# EAGLE design shield (EAGLE 6.4)
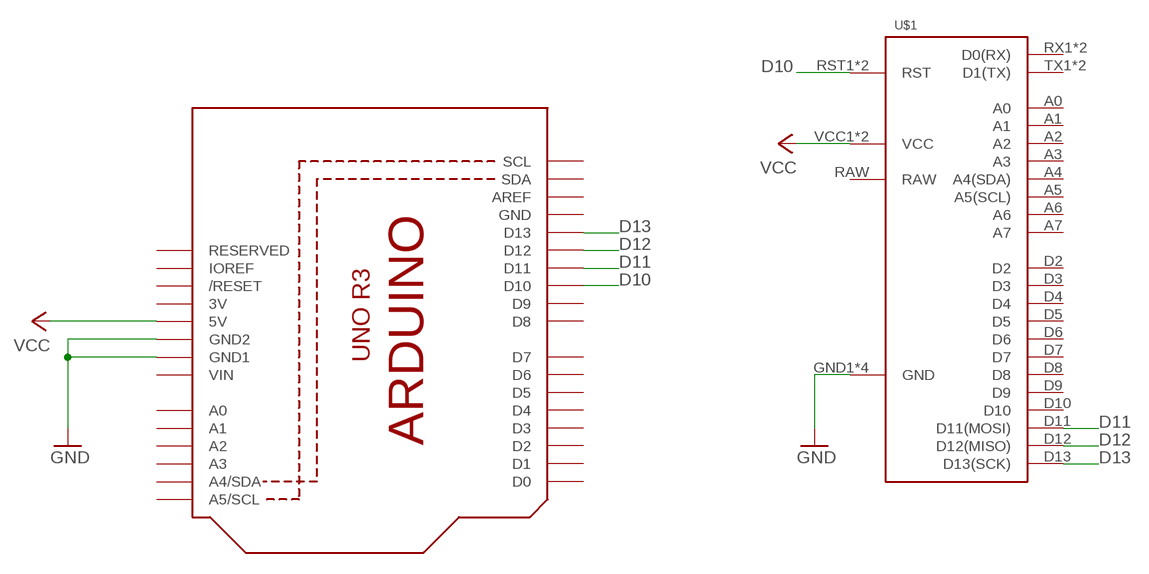
[diagram p0: schematic, sheet 1]

## Parts
U1  ARDUINOR3-DIMENSION  [ARDUINOR3]
U$1  ARDUINO-PRO-MINI  [ARDUINO-PRO-MINI]

## Nets
D10: U1.D10 U$1.RST1(RST) U$1.RST2(RST)
D11: U1.D11 U$1.D11(D11(MOSI))
D12: U1.D12 U$1.D12(D12(MISO))
D13: U1.D13 U$1.D13(D13(SCK))
GND: U1.GND1 U1.GND2 U$1.GND1(GND) U$1.GND2(GND) U$1.GND3(GND) U$1.GND4(GND)
VCC: U1.5V U$1.VCC1(VCC) U$1.VCC2(VCC)
Unconnected: U1.A0 U1.A1 U1.A2 U1.A3 U1.A4(A4/SDA) U1.A5(A5/SCL) U1.AREF U1.D0 U1.D1 U1.D2 U1.D3 U1.D4 U1.D5 U1.D6 U1.D7 U1.D8 U1.D9 U1.IOREF U1.RESERVED U1.RESET(/RESET) U1.SCL U1.SDA U$1.A0 U$1.A1 U$1.A2 U$1.A3 U$1.A4(A4(SDA)) U$1.A5(A5(SCL)) U$1.A6 U$1.A7 U$1.D2 U$1.D3 U$1.D4 U$1.D5 U$1.D6 U$1.D7 U$1.D8 U$1.D9 U$1.D10 U$1.RX1(D0(RX)) U$1.RX2(D0(RX)) U$1.TX1(D1(TX)) U$1.TX2(D1(TX))

## Power pins joined to a net without a drawn wire
3V: U1.3V
GND: U1.GND
RAW: U$1.RAW
VIN: U1.VIN

## Library data of the parts
U1 = adafruit:ARDUINOR3: This is a new object for the new Arduino R3 - with extra pins that you may want to use (such as IOref, and duplicated A4/A5
U$1 = serge:ARDUINO-PRO-MINI

## Board
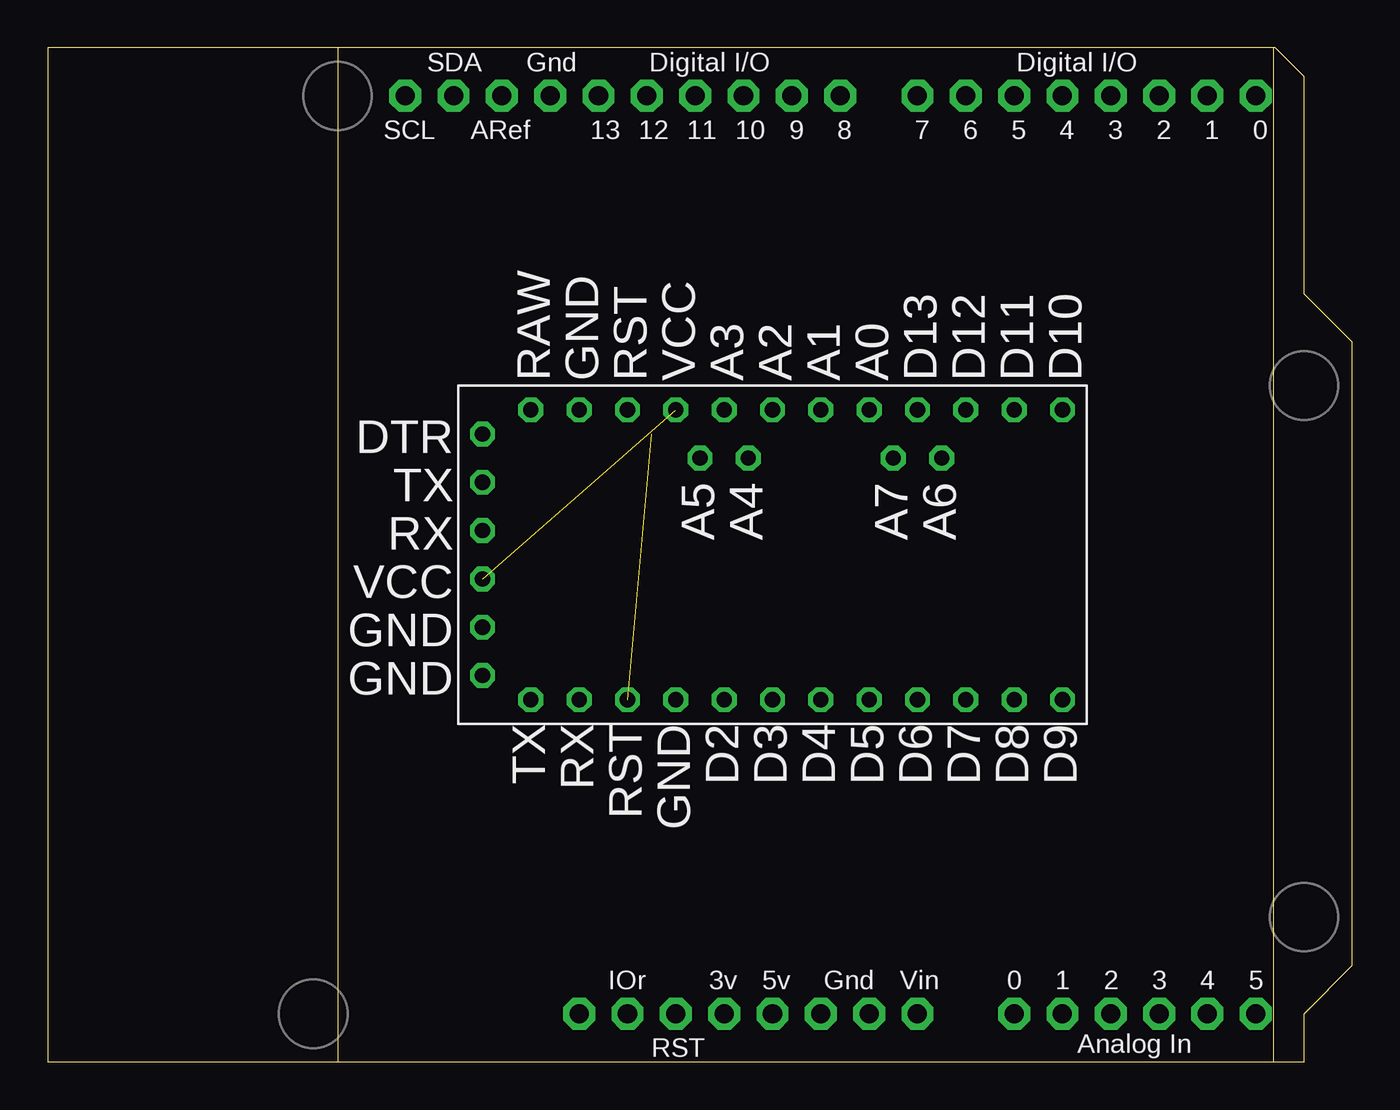
[diagram p1: board, top side]
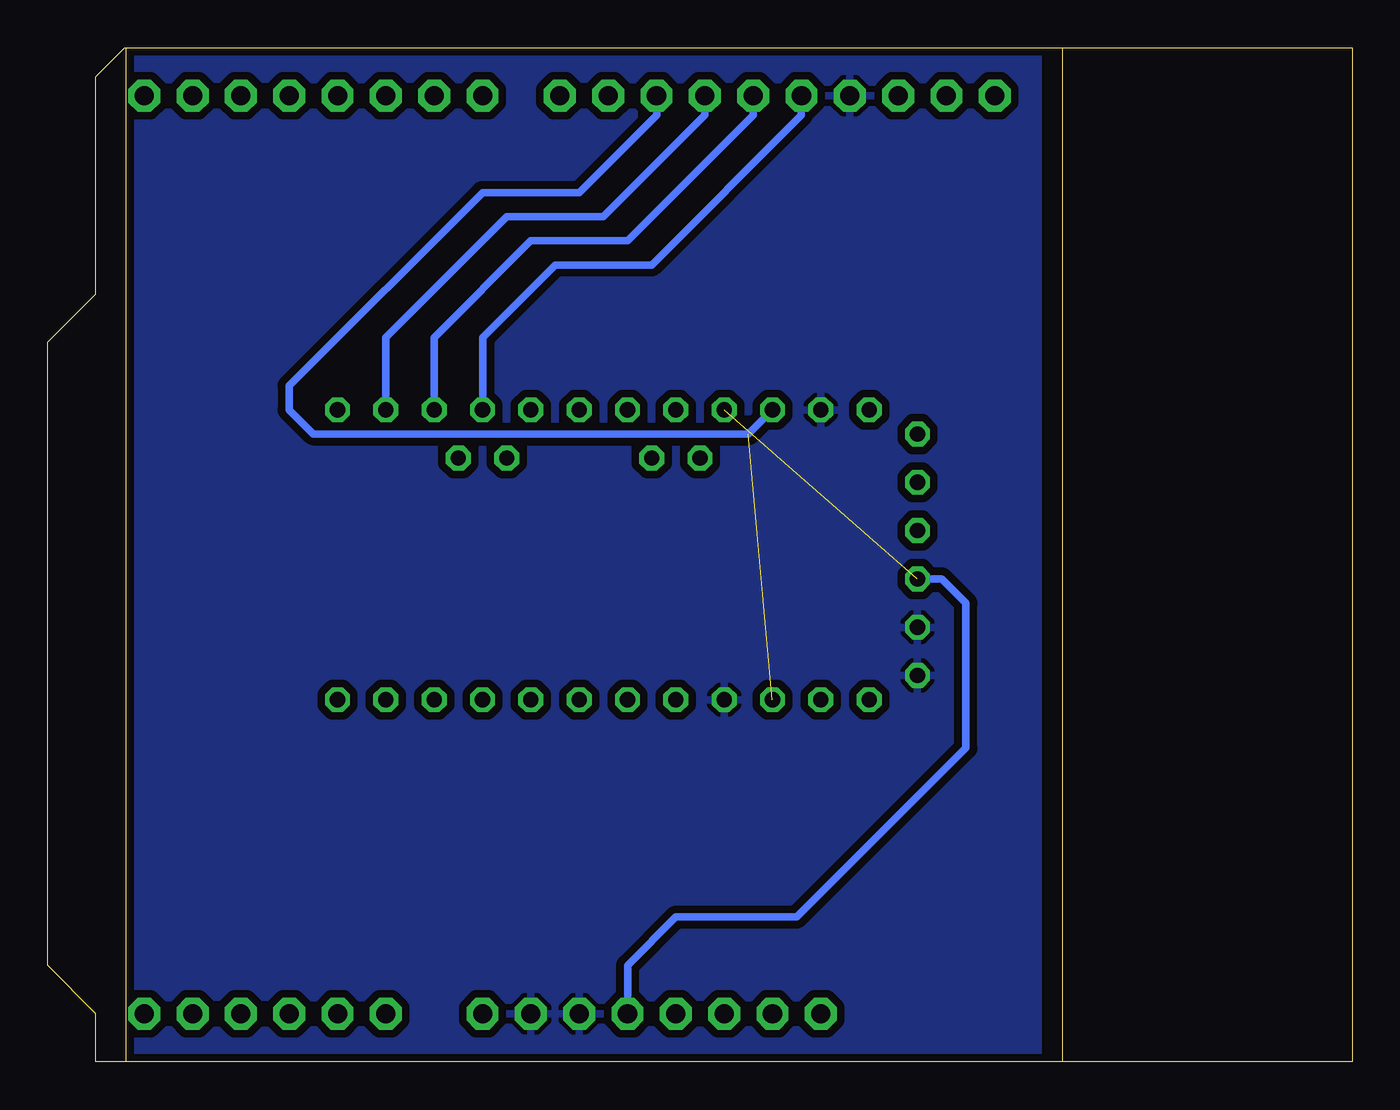
[diagram p2: board, bottom side, seen from below]

Size 49.2 x 53.33 mm. Coordinates in mm from the lower left corner, seen from the top.
Outline: 0,0 49.2,0 49.2,53.33 0,53.33 0,0
Copper layers (1*16): Top 0.035mm / dielectric 1.5mm / Bottom 0.035mm
Design rules "default": minimum track width 10mil, minimum drill 24mil, track to track 16mil, track to pad 16mil, pad to pad 16mil, via to via 16mil, smd to smd 16mil, copper to edge 16mil, drill to drill 8mil, minimum pad ring 10mil, minimum via ring 8mil, stop-mask expansion 4mil, vias tented up to drill 0mil, thermal gap 10mil

### Footprints (pad centres in the part's own frame; a part is rotated, then mirrored left to right if it is on the bottom)
ARDUINOR3 = drill 1 pad 1.676 octagon: 3V 35.56,2.54; 5V 38.1,2.54; A0 50.8,2.54; A1 53.34,2.54; A2 55.88,2.54; A3 58.42,2.54; A4 60.96,2.54; A5 63.5,2.54; AREF 23.876,50.8; D0 63.5,50.8; D1 60.96,50.8; D2 58.42,50.8; D3 55.88,50.8; D4 53.34,50.8; D5 50.8,50.8; D6 48.26,50.8; D7 45.72,50.8; D8 41.656,50.8; D9 39.116,50.8; D10 36.576,50.8; D11 34.036,50.8; D12 31.496,50.8; D13 28.956,50.8; GND 26.416,50.8; GND1 43.18,2.54; GND2 40.64,2.54; IOREF 30.48,2.54; RESERVED 27.94,2.54; RESET 33.02,2.54; SCL 18.796,50.8; SDA 21.336,50.8; VIN 45.72,2.54
ARDUINO-PRO-MINI = drill 0.8 octagon: A0 -3.81,-7.62; A1 -1.27,-7.62; A2 1.27,-7.62; A3 3.81,-7.62; A4 2.54,-5.08; A5 5.08,-5.08; A6 -7.62,-5.08; A7 -5.08,-5.08; D2 3.81,7.62; D3 1.27,7.62; D4 -1.27,7.62; D5 -3.81,7.62; D6 -6.35,7.62; D7 -8.89,7.62; D8 -11.43,7.62; D9 -13.97,7.62; D10 -13.97,-7.62; D11 -11.43,-7.62; D12 -8.89,-7.62; D13 -6.35,-7.62; DTR 16.51,-6.35; GND1 11.43,-7.62; GND2 16.51,6.35; GND3 16.51,3.81; GND4 6.35,7.62; RAW 13.97,-7.62; RST1 8.89,7.62; RST2 8.89,-7.62; RX1 11.43,7.62; RX2 16.51,-1.27; TX1 13.97,7.62; TX2 16.51,-3.81; VCC1 16.51,1.27; VCC2 6.35,-7.62

### Placement (x,y rotation side)
U1  -15.24,0 0 top
U$1  24.13,26.67 180 top

### Tracks (layer width: path | path; a pad name or v marks a point on that pad's centre or on a via)
D10  (1 unrouted)
  Bottom 0.406: U1.D10 21.34,49.78 25.4,45.72 30.48,45.72 40.64,35.56 40.64,34.29 39.37,33.02 16.51,33.02 U$1.RST2
D11
  Bottom 0.406: U1.D11 18.8,49.78 24.13,44.45 29.21,44.45 35.56,38.1 U$1.D11
D12
  Bottom 0.406: U$1.D12 33.02,38.1 27.94,43.18 22.86,43.18 16.26,49.78 U1.D12
D13
  Bottom 0.406: U1.D13 13.72,49.78 21.59,41.91 26.67,41.91 30.48,38.1 U$1.D13
GND
  pour Bottom: 1.27,53.34 50.8,53.34 50.8,0 1.27,0
VCC  (1 unrouted)
  Bottom 0.406: U1.5V 22.86,5.08 20.32,7.62 13.97,7.62 5.08,16.51 5.08,24.13 6.35,25.4 U$1.VCC1